# Altium schematic sheet asu racing team solo.SchDoc
size A3; SheetNumber: 1; SheetTotal: 1
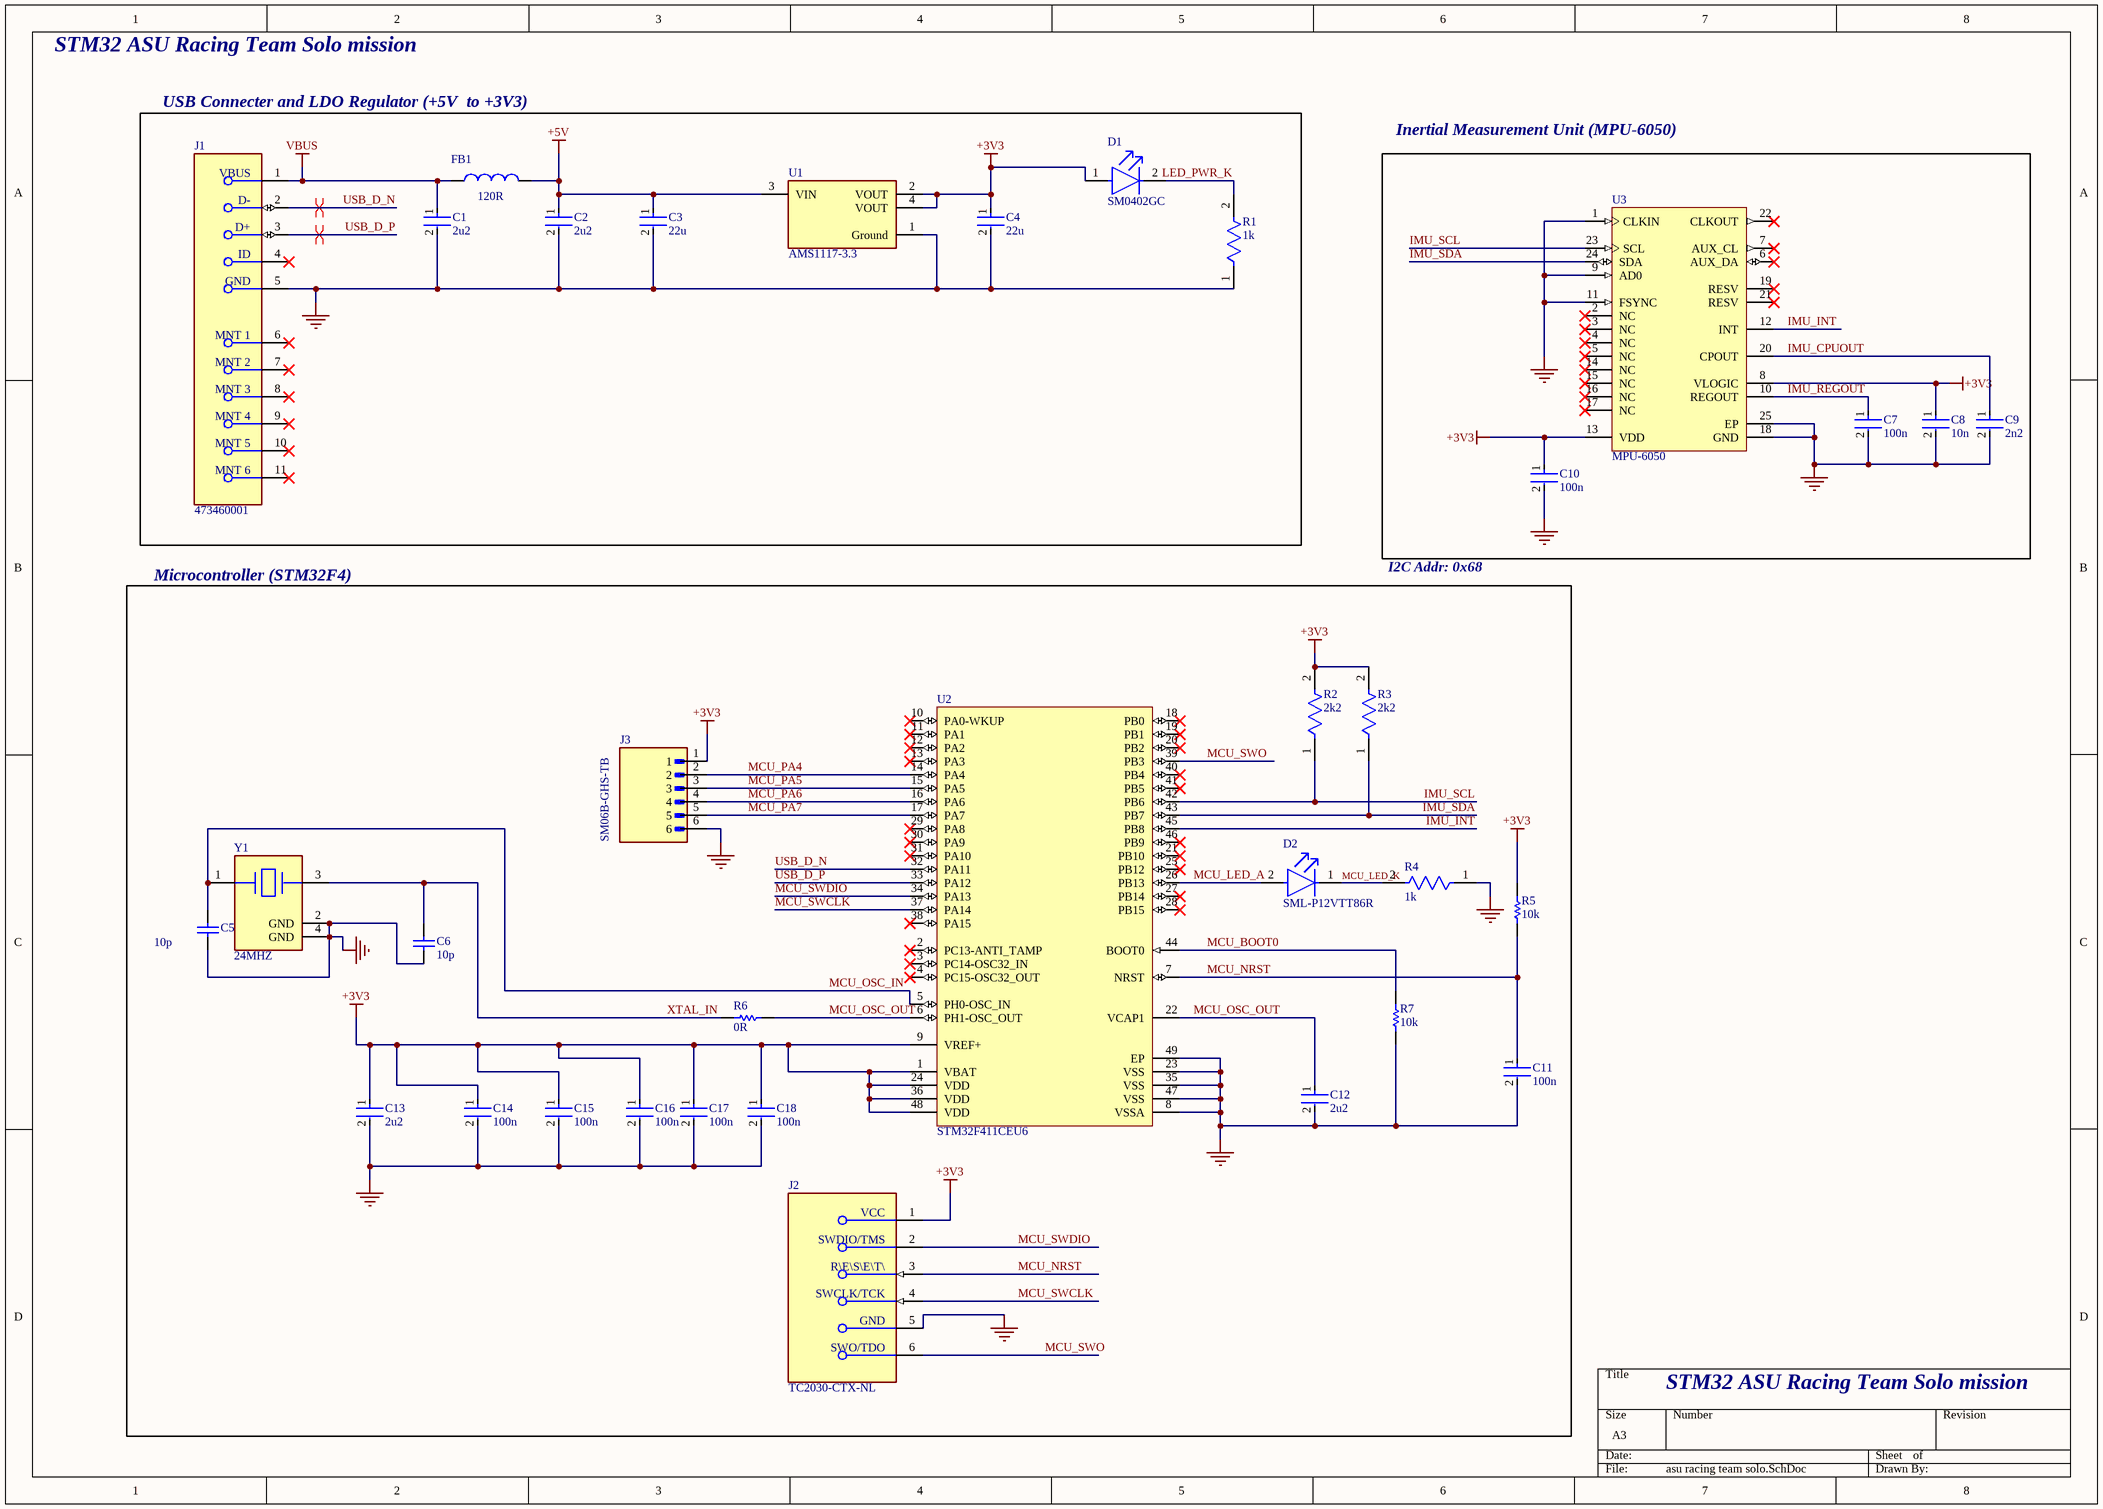
[diagram p0: asu racing team solo.SchDoc]

## Parts
C1  2u2  [FP-C0603C-CF-MFG]
C2  2u2  [FP-C0603C-CF-MFG]
C3  22u  [FP-C0805C106K4PACTU-MFG]
C4  22u  [FP-C0805C106K4PACTU-MFG]
C5  10p  [CAPC1005X56X25ML10T15]
C6  10p  [CAPC1005X56X25ML10T15]
C7  100n  [FP-C0402-BB-MFG]
C8  10n  [FP-C0402-BB-MFG]
C9  2n2  [FP-C0402-BB-MFG]
C10  100n  [FP-C0402-BB-MFG]
C11  100n  [FP-C0402-BB-MFG]
C12  2u2  [FP-C0603C-CF-MFG]
C13  2u2  [FP-C0603C-CF-MFG]
C14  100n  [FP-C0402-BB-MFG]
C15  100n  [FP-C0402-BB-MFG]
C16  100n  [FP-C0402-BB-MFG]
C17  100n  [FP-C0402-BB-MFG]
C18  100n  [FP-C0402-BB-MFG]
D1  SM0402GC  [FP-SM0402GC-MFG]
D2  SML-P12VTT86R  [FP-SML-P1-MFG]
FB1  120R  [WE-CBF HF_0603_HC]
J1  473460001  [FP-473460001-MFG]
J2  TC2030-CTX-NL  [FP-TC2030-CTX-NL-MFG]
J3  SM06B-GHS-TB  [JST_SM06B-GHS-TB]
R1  1k  [FP-RC0402-0_4-IPC_A]
R2  2k2  [FP-RC0402-0_4-IPC_A]
R3  2k2  [FP-RC0402-0_4-IPC_A]
R4  1k  [FP-RC0402-0_4-IPC_A]
R5  10k  [RESC1005X40X25LL05T10]
R6  0R  [RESC1005X40X25LL05T10]
R7  10k  [RESC1005X40X25LL05T10]
U1  AMS1117-3.3  [FP-AMS1117-IPC_C]
U2  STM32F411CEU6  [STM-UFQFPN48_L]
U3  MPU-6050  [IS-QFN-24_V]
Y1  24MHZ  [FP-ABM8-MFG]

## Blocks framed on the sheet
USB Connecter and LDO Regulator (+5V  to +3V3): C1-C4 D1 FB1 J1 R1 U1
Inertial Measurement Unit (MPU-6050): C7-C10 U3
Microcontroller (STM32F4): C5 C6 C11-C18 D2 J2 J3 R2-R7 U2 Y1

## Nets
+3V3: C4.1 C8.1 C10.1 C13.1 C14.1 C15.1 C16.1 C17.1 C18.1 D1.1(A) J2.1(VCC) J3.1 R2.2 R3.2 R5.2 U1.2(VOUT) U1.4(VOUT) U2.1(VBAT) U2.9(VREF+) U2.24(VDD) U2.36(VDD) U2.48(VDD) U3.8(VLOGIC) U3.13(VDD)
+5V: C2.1 C3.1 FB1.2 U1.3(VIN)
GND: C1.2 C2.2 C3.2 C4.2 C5.1 C6.1 C7.2 C8.2 C9.2 C10.2 C11.2 C12.2 C13.2 C14.2 C15.2 C16.2 C17.2 C18.2 J1.5(GND) J2.5(GND) J3.6 R1.1 R4.1 R7.1 U1.1(Ground) U2.8(VSSA) U2.23(VSS) U2.35(VSS) U2.47(VSS) U2.49(EP) U3.1(CLKIN) U3.9(AD0) U3.11(FSYNC) U3.18(GND) U3.25(EP) Y1.2(GND) Y1.4(GND)
VBUS: C1.1 FB1.1 J1.1(VBUS)
IMU_CPUOUT: C9.1 U3.20(CPOUT)
IMU_INT: U2.45(PB8) U3.12(INT)
IMU_REGOUT: C7.1 U3.10(REGOUT)
IMU_SCL: R2.1 U2.42(PB6) U3.23(SCL)
IMU_SDA: R3.1 U2.43(PB7) U3.24(SDA)
LED_PWR_K: D1.2(C) R1.2
MCU_BOOT0: R7.2 U2.44(BOOT0)
MCU_LED_A: D2.2(A) U2.26(PB13)
MCU_LED_K: D2.1(C) R4.2
MCU_NRST: C11.1 J2.3(~{RESET}) R5.1 U2.7(NRST)
MCU_OSC_IN: C5.2 U2.5(PH0-OSC_IN) Y1.1
MCU_OSC_OUT: C12.1 R6.2 U2.6(PH1-OSC_OUT) U2.22(VCAP1)
MCU_PA4: J3.2 U2.14(PA4)
MCU_PA5: J3.3 U2.15(PA5)
MCU_PA6: J3.4 U2.16(PA6)
MCU_PA7: J3.5 U2.17(PA7)
MCU_SWCLK: J2.4(SWCLK/TCK) U2.37(PA14)
MCU_SWDIO: J2.2(SWDIO/TMS) U2.34(PA13)
MCU_SWO: J2.6(SWO/TDO) U2.39(PB3)
USB_D_N: J1.2(D-) U2.32(PA11)
USB_D_P: J1.3(D+) U2.33(PA12)
XTAL_IN: C6.2 R6.1 Y1.3

Not connected (* = marked no-connect by the designer): J1 4(ID)* 6(MNT_1)* 7(MNT_2)* 8(MNT_3)* 9(MNT_4)* 10(MNT_5)* 11(MNT_6)*; U2 2(PC13-ANTI_TAMP)* 3(PC14-OSC32_IN)* 4(PC15-OSC32_OUT)* 10(PA0-WKUP)* 11(PA1)* 12(PA2)* 13(PA3)* 18(PB0)* 19(PB1)* 20(PB2)* 21(PB10)* 25(PB12)* 27(PB14)* 28(PB15)* 29(PA8)* 30(PA9)* 31(PA10)* 38(PA15)* 40(PB4)* 41(PB5)* 46(PB9)*; U3 2(NC)* 3(NC)* 4(NC)* 5(NC)* 6(AUX_DA)* 7(AUX_CL)* 14(NC)* 15(NC)* 16(NC)* 17(NC)* 19(RESV)* 21(RESV)* 22(CLKOUT)*

## Layout directives
differential pair; differential pair class DIFF_USB: USB_D_N, USB_D_P

## Notes on the sheet
- STM32 ASU Racing Team Solo mission
- I2C Addr: 0x68

## Library data of the parts
C1 C2 C12 C13 = CMP-2006-03811-3: Capacitor; Ceramic; Cap; .100uF; Tol 10%; SMT; Vol-Rtg 16V; X7R; Tape and Reel; Manufacturer Part Number: C0603C104K4RACTU; Manufacturer: KEMET; Value: 0.10 μF; Temperature Coefficient: 30ppm/°C; Automotive Grade: Grade 1; Tolerance: 0.1; Digikey Description: Capacitor; Ceramic; Cap; .100uF; Tol 10%; SMT; Vol-Rtg 16V; X7R; Tape and Reel; Automotive: Yes; Temperature Range High: +125°C; Device Class L1: Passive Components; Material: Ceramic; Lead Free: Yes; Device Class L2: Capacitors; Capacitance: 0.10 μF; Height: 0.87mm; Voltage Rating: 16 V; Octopart: https://octopart.com/c0603c104k4ractu-kemet-93067; Package: C0603C-CF; Temperature Characteristic: X7R; Device Class L3: Ceramic Capacitors; ComponentLink2URL: https://api.kemet.com/component-edge/download/datasheet/C0603C100J5GACAUTO.pdf; Temperature Range Low: -55°C; ComponentLink2Description: Datasheet; Mouser Description: Multilayer Ceramic Capacitors MLCC - SMD/SMT 16volts 0.1uF 10% X7R 10%; RoHS: TRUE; Temperature: -55°C to +125°C; Category: Cap
C3 C4 = CMP-03020-034671-1: CAP CER 10UF 16V X5R 0805; Dissipation Factor: 5%; Tolerance: 10%; Dielectric Material: Ceramic; REACH SVHC: No SVHC; Packaging: Tape and Reel; Series: C; Min Operating Temperature: -55°C; Construction: Flat; Radiation Hardening: No; Case Code (Metric): 2012; Contact Plating: Tin; Case Code (Imperial): 0805; Voltage Rating: 16V; Mount: Surface Mount; Width: 0.049inch; Voltage: 16V; Dielectric: X5R; Height: 1.25mm; Depth: 1.25mm; Case/Package: 0805; Max Operating Temperature: 85°C; Length: 2mm; Thickness: 0.055inch; Termination: SMD/SMT; Capacitance: 10uF; Number of Pins: 2; Voltage Rating (DC): 16V; Lead Free: Lead Free; Package Quantity: 1
C5 C6 = CMP-2008-02838-1: Manufacturer: AVX Interconnect / Elco; Part Number: 0402YC821KAT2A
C7-C11 C14-C18 = CMP-03020-013852-1: C0402 22 pF X7R 10.00% 16 V; Manufacturer: Kemet; Manufacturer Part Number: C0402C220K4RACTU; Capacitance: 22 pF; Tolerance: 0.1; Material: Ceramic; Temperature Coefficient: 15%; Value: 22 pF; Voltage Rating: 16 V; Ipc Land Pattern Name: CAPC10050X50; ComponentLink2Description: Datasheet; Device Class L3: Ceramic Capacitors; Automotive: No; Mouser Description: Cap Ceramic 22pF 16V X7R 10% Pad SMD 0402 125C T/R; Package: C0402-BB; Octopart: https://octopart.com/c0402c220k4ractu-kemet-77858932; Height: 0.55mm; Temperature Characteristic: X7R; Lead Free: Yes; Category: Cap; Temperature: -55°C to +125°C; Device Class L2: Capacitors; Device Class L1: Passive Components; Temperature Range High: +125°C; ComponentLink2URL: https://content.kemet.com/datasheets/KEM_C1002_X7R_SMD.pdf; Temperature Range Low: -55°C; RoHS: TRUE
D1 = CMP-35283-000001-2: LED GREEN CLEAR 0402 SMD; Lens Size: 1mm; Luminous Intensity: 28.5mcd; Viewing Angle: 130°; Forward Voltage: 1.9V; Test Current: 20mA; Lens Color: Colorless; Lens Style: Flat; Dominant Wavelength: 572nm; Case Code (Metric): 1005; Mount: Surface Mount; Case Code (Imperial): 0402; Length: 1mm; Width: 0.5mm; Case/Package: 0402; Lens Transparency: Clear; Height: 0.71mm; Packaging: Tape and Reel; Color: Green
D2 = CMP-08952-000002-1: LED RED CLEAR 0402 SMD; Manufacturer: Rohm; Wavelength: 630nm; Luminous Intensity: 60mcd; Led Orientation: Top View; Forward Current: 20mA; Reverse Voltage: 5V; Power Dissipation: 50mW; Forward Voltage: 2V; Mouser Description: SML-P1 Series Red 0402 Clear 60 mcd 2V Surface Mount PICOLED? LED; Package: SML-P1; Colour: Red; Temperature Range Low: -40°C; Octopart: https://octopart.com/sml-p12vtt86r-rohm-34112315; Automotive: No; Temperature: -40°C to +85°C; Digikey Description: LED RED CLEAR 0402 SMD; ComponentLink2URL: https://www.rohm.com/datasheet/SML-P12VT(R)/sml-p1-e; Device Class L1: Optoelectronics; Device Class L3: unset; Category: Diode; Temperature Range High: +85°C; ComponentLink2Description: Datasheet; Lead Free: Yes; Manufacturer Part Number: SML-P12VTT86R; RoHS: TRUE; Device Class L2: LEDs; Height: 0.25mm
FB1 = CMP-0220-00101-3: Ferrite Bead (emi Suppression), 1.6X0.8X0.8MM (0603), 600O Impedance At 100 Mhz; Current Rating: 400mA; DC Resistance (DCR): 220mΩ; Max Current Rating: 500mA; Impedance: 600Ω; Tolerance: 25%; Resistance: 350mΩ; Number of Lines: 1; Test Frequency: 100MHz; Height: 800µm; Min Operating Temperature: -55°C; Length: 1.6mm; Width: 800µm; Case Code (Imperial): 0603; Depth: 800µm; Number of Pins: 2; Case Code (Metric): 1608; Case/Package: SMD/SMT; Lead Free: Lead Free; Core Material: Ferrite; Max Operating Temperature: 125°C; Termination: SMD/SMT; RoHS: Compliant; REACH SVHC: Unknown; Max DC Current: 500mA; Mount: Surface Mount
J1 = CMP-2000-05246-2: CONN RCPT USB2.0 MICRO B SMD R/A; Manufacturer: Molex; Conn Orientation: Right Angle; Is Female: yes; Shielding: true; Pitch: 0.65mm; Number Of Contacts: 5; Voltage Rating: 30V; Current Rating: 1.8A; Device Class L2: USB Connectors; Digikey Description: CONN RCPT USB2.0 MICRO B SMD R/A; Height: 2.945mm; RoHS: TRUE; ComponentLink2Description: Datasheet; Octopart: https://octopart.com/47346-0001-molex-7164928; Automotive: No; Package: 0; Category: Conn; Device Class L1: Connectors; Usb Standard: USB 2.0; Temperature: -30°C to +85°C; Temperature Range Low: -30°C; Footprint Url: https://www.molex.com/pdm_docs/sd/473460001_sd.pdf; ComponentLink2URL: https://www.molex.com/webdocs/datasheets/pdf/en-us/0473460001_IO_CONNECTORS.pdf; Lead Free: Yes; Manufacturer Part Number: 473460001; Contact Material: Gold,Nickel; Temperature Range High: +85°C; Device Class L3: unset
J2 = CMP-205963-000001-1: 6-Pin “No legs” TC2030 Plug-of-Nails™ Cable for use with ARM Cortex processors
J3 = SM06B-GHS-TB: Connector Header Surface Mount, Right Angle 6 position 0.049 (1.25mm); MF: JST Sales; SnapEDA_Link: https://www.snapeda.com/parts/SM06B-GHS-TB/JST/view-part/?ref=snap; Package: None; Value: *; MP: SM06B-GHS-TB; Check_prices: https://www.snapeda.com/parts/SM06B-GHS-TB/JST/view-part/?ref=eda
R1-R4 = CMP-2002-07472-3: RES 1K OHM 1% 1/16W 0402; Max Power Dissipation: 63mW; Resistance: 1kR; Voltage Rating (DC): 50V; Temperature Coefficient: 100ppm/°C; Power Rating: 62.5mW; Technology: THICK FILM; Size Code: 0402; Series: RC; Length: 1mm; Case/Package: 0402; Features: Moisture Resistant; Termination: SMD/SMT; Case Code (Metric): 1005; Reach SVHC Compliant: Yes; Number of Terminations: 2; Tolerance: 1%; Lead Free: Lead Free; Military Standard: Not; Resistor Type: Thick Film; Max Operating Temperature: 155°C; RoHS Compliant: Yes; Construction: Rectangular; Voltage Rating: 50V; Packaging: Tape and Reel; Height: 0.32mm; Number of Pins: 2; Resistance Tolerance: 1%; Case Code (Imperial): 0402; Depth: 0.5mm; Min Operating Temperature: -55°C; Width: 0.5mm
R5-R7 = CMP-2002-07353-1: Part Number: RC0402FR-0710KL; Manufacturer: Yageo / Phycomp
U1 = CMP-209535-000001-1: LDO Voltage Regulators 1A, 3.3V; Manufacturer: Advanced Monolithic Systems; Dropout Voltage: 1.1V; Output Type: Fixed; Nominal Supply Current: 5mA; Max Power Dissipation: 1.2W; Max Supply Voltage: 15V; Number Of Outputs: 1; Standoff Height: 0.64mm; Max Junction Temp: +125°C; Height: 1.8mm; Package: AMS1117; Device Class L2: Power Management ICs; ComponentLink2Description: Datasheet; ComponentLink2URL: http://www.advanced-monolithic.com/pdf/ds1117.pdf; Category: IC; RoHS: TRUE; Automotive: No; Device Class L1: Integrated Circuits (ICs); Output Current: 1A; Device Class L3: Voltage Regulators - Linear; Temperature: -40°C to +125°C; Output Voltage: 3.3V; Manufacturer Part Number: AMS1117-3.3; Temperature Range Low: -40°C; Octopart: https://octopart.com/ams1117-3.3-advanced+monolithic+systems-25899300; Lead Free: Yes; Ipc Land Pattern Name: SOT229P700X180-4; Temperature Range High: +125°C
U2 = CMP-0243-00165-1: ARM Cortex-M4 32-bit MCU+FPU, 512 KB Flash, 128 KB RAM, 36 I/Os, 48-Pin UFQFPN, -40 to 85 degC, Tray; Operating Frequency(F) (Processor speed) (MHz): 100; FLASH Size (Prog) (kB): 512; Internal RAM Size (kB): 128; I/Os (High Current): 36; Supply Voltage(Vcc) min (V): 1.7; Package Reference: 48-Pin Ultra Thin Fine Pitch Quad Flat No-Lead, 7 x 7 x 0.6 mm Body, 0.5 mm Pitch, Exposed Pad; ComponentLink1Description: Manufacturer URL; ComponentLink1URL: http://www.st.com/; Packing: Tray; Package Description: UFQFPN48; Core: ARM Cortex-M4; ComponentLink2Description: Datasheet; ComponentLink2URL: http://www.st.com/st-web-ui/static/active/en/resource/technical/document/datasheet/DM00115249.pdf; DatasheetVersion: Rev. 6; Mounting Technology: Surface Mount
U3 = CMP-1753-00002-2: 3-Axis Gyroscope, Accelerometer and a Digital Motion Processor(TM) (DMP), 2.375 to 3.46 V, -40 to 85 degC, 24-Pin QFN, RoHS, Tape and Reel; Manufacturer: InvenSense; Featured Product: MPU-60506-Axis,IntegratedI²CSolution; Other Names: 1428-1007-2 / MPU6050; Sensor Type: MotionTracking; Online Catalog: MPU-6000™Series; Unit PriceUSD: Digital; Datasheet Version: Rev. 3.3, 05/2012; Category: Sensors,Transducers; Datasheet URL: http://datasheet.octopart.com/MPU-6050-InvenSense-datasheet-14421344.pdf; Family: Multifunction; Standard Package: 5,000; Manufacturer URL: http://www.invensense.com/; Output Type: Digital; Dynamic Catalog: MPU-6000™Series
Y1 = CMP-27762-000036-1: Crystal 24MHz ±20ppm 18pF SMD-4 3.2mm x 2.5mm; ESR (Equivalent Series Resistance): 50R; Frequency Stability: 50ppm; Min Operating Temperature: -20°C; Width: 2.5mm; Series Resistance: 50R; Frequency Tolerance: 20ppm; Tolerance: 20ppm; Load Capacitance: 18pF; Mount: Surface Mount; Height: 0.031inch; RoHS Compliant: Yes; Frequency: 24MHz; Radiation Hardening: No; Packaging: Tape and Reel; Lead Free: Lead Free; Resistor Type: Ceramic; Series: ABM8; Termination: SMD/SMT; Length: 3.2mm; Max Operating Temperature: 70°C; Case/Package: CSMD; Package Quantity: 1000; Depth: 2.5mm; Number of Pins: 4; Operating Frequency: 24 MHz; Accuracy: 20ppm; REACH SVHC: No SVHC